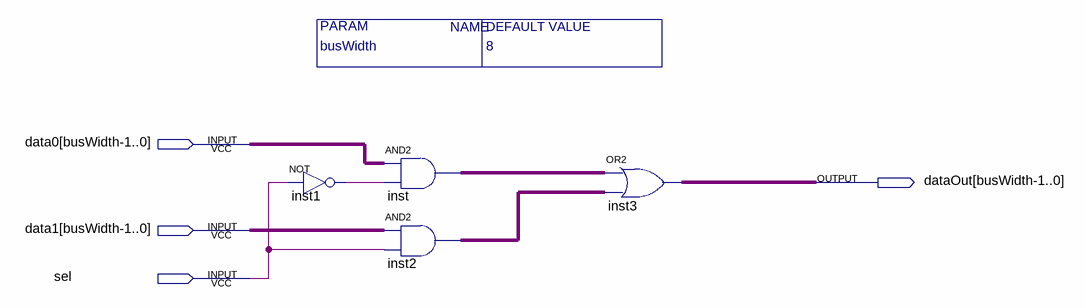
[diagram p0: schematic sheet]
// Quartus schematic testmux2.bdf as structural Verilog: 4 symbols, 4 pins
module testmux2 #(parameter busWidth = 8) (
  input  [7:0] data0,
  input  [7:0] data1,
  input  sel,
  output [7:0] dataOut
);

  wire inst1_out;
  wire [7:0] inst2_out, inst_out;

  not inst1 (inst1_out, sel);
  assign inst_out = data0 & {8{inst1_out}};  // AND2 inst, 8 bits wide
  assign inst2_out = data1 & {8{sel}};  // AND2 inst2, 8 bits wide
  assign dataOut = inst_out | inst2_out;  // OR2 inst3, 8 bits wide
endmodule
